# EAGLE schematic brick_i2c_proximity_mini (EAGLE 7.4.0)
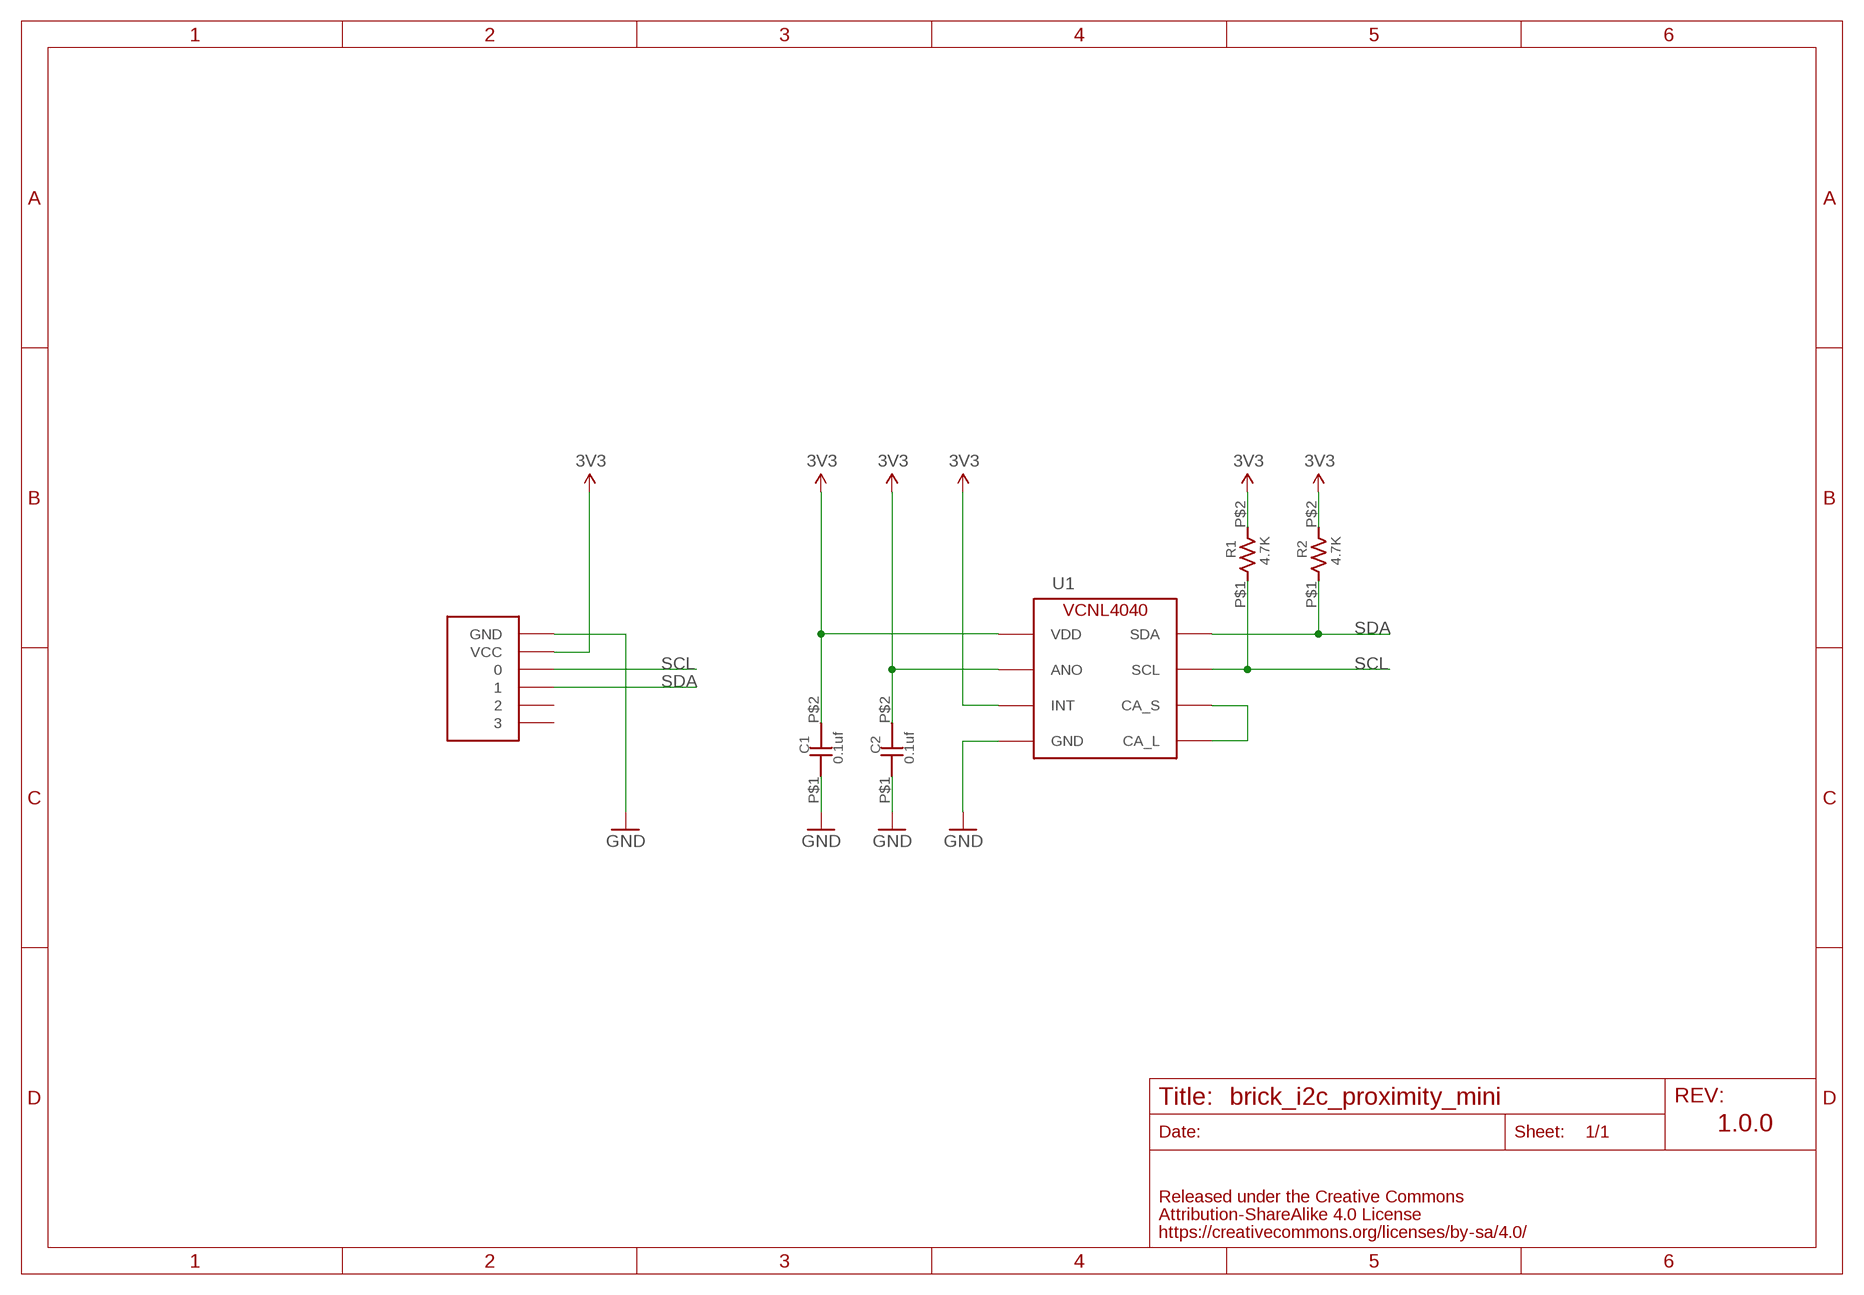
[diagram p0: schematic, sheet 1]

## Parts
C1  0.1uf  0402  [0402]
C2  0.1uf  0402  [0402]
R1  4.7K  0402  [0402]
R2  4.7K  0402  [0402]
U1  VCNL4040M3OE  [VCNL4040M3OE]
U$2  FABO-NANO  [FABO-NANO]

## Nets
3V3: C1.P$2 C2.P$2 R1.P$2 R2.P$2 U1.3(VDD) U1.4(ANO) U1.6(INT) U$2.VCC
GND: C1.P$1 C2.P$1 U1.1(GND) U$2.GND
N$1: U1.2(CA_S) U1.5(CA_L)
SCL: R1.P$1 U1.8(SCL) U$2.0
SDA: R2.P$1 U1.7(SDA) U$2.1
Unconnected: U$2.2 U$2.3

## Notes on the sheet
- 1.0.0

## Library data of the parts
C1 C2 = FaBo-Capacitor:0402: CAPACITOR 0402
R1 R2 = FaBo-Resistors:0402
U1 = FaBo-Sensor:VCNL4040
U$2 = FaBo-Template:FABO-NANO